# Altium project GatewayV2.PrjPcb
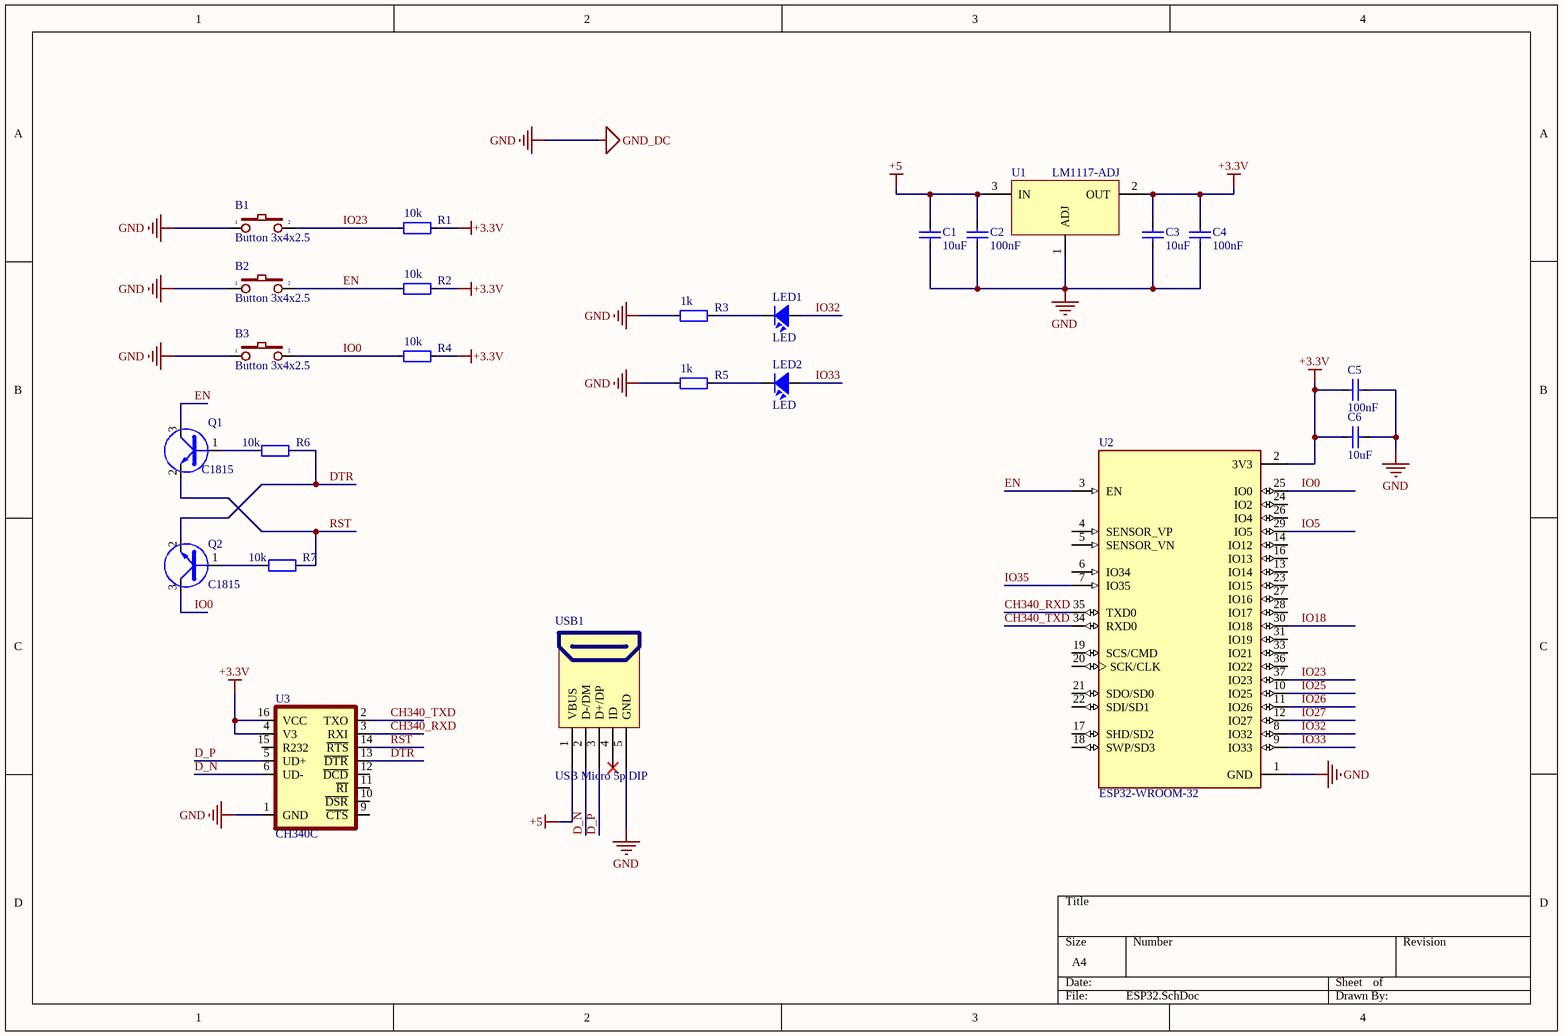
[diagram p0: ESP32.SchDoc]
2 sheets, 52 parts. Net scope: global (net labels, ports and power ports of the same name join across sheets).
Board file: GatewayV2.PcbDoc
Sheets:
  ESP32.SchDoc
  Power.SchDoc

## Sheet ESP32.SchDoc
size A4; SheetNumber: 1; SheetTotal: 2

### Parts
B1  Button 3x4x2.5  [Button 3x4x2.5]
B2  Button 3x4x2.5  [Button 3x4x2.5]
B3  Button 3x4x2.5  [Button 3x4x2.5]
C1  10uF  [CAP_0805]
C2  100nF  [CAP_0805]
C3  10uF  [CAP_0805]
C4  100nF  [CAP_0805]
C5  100nF  [CAP_0805]
C6  10uF  [CAP_0805]
LED1  LED  [LED-0805-Red]
LED2  LED  [LED-0805-Red]
Q1  C1815  [SOT23D]
Q2  C1815  [SOT23D]
R1  10k  [RES-SMD-0805]
R2  10k  [RES-SMD-0805]
R3  1k  [RES-SMD-0805]
R4  10k  [RES-SMD-0805]
R5  1k  [RES-SMD-0805]
R6  10k  [RES-SMD-0805]
R7  10k  [RES-SMD-0805]
U1  LM1117-ADJ  [LM1117-SOP]
U2  ESP32-WROOM-32  [MODULE_ESP32-WROOM-32]
U3  CH340C  [SO016]
USB1  USB Micro 5p DIP  [USB Micro 5p DIP]

### Nets
+3.3V: C3.1 C4.1 C5.1 C6.1 R1.1 R2.1 R4.1 U1.2(OUT) U2.2(3V3) U3.4(V3) U3.16(VCC)
+5: C1.1 C2.1 U1.3(IN) USB1.1(VBUS)
GND: B1.1 B2.1 B3.1 C1.2 C2.2 C3.2 C4.2 C5.2 C6.2 R3.2 R5.2 U1.1(ADJ) U2.1(GND) U3.1(GND) USB1.5(GND)  [also labelled GND_DC]
CH340_RXD: U2.35(TXD0) U3.3(RXI)
CH340_TXD: U2.34(RXD0) U3.2(TXO)
D_N: U3.6(UD-) USB1.2(D-/DM)
D_P: U3.5(UD+) USB1.3(D+/DP)
DTR: Q2.2(E) R6.1 U3.13(~{DTR})
EN: B2.2 Q1.3(C) R2.2 U2.3(EN)
IO0: B3.2 Q2.3(C) R4.2 U2.25(IO0)
IO5: U2.29(IO5)
IO18: U2.30(IO18)
IO23: B1.2 R1.2 U2.37(IO23)
IO25: U2.10(IO25)
IO26: U2.11(IO26)
IO27: U2.12(IO27)
IO32: LED1.1 U2.8(IO32)
IO33: LED2.1 U2.9(IO33)
IO35: U2.7(IO35)
RST: Q1.2(E) R7.1 U3.14(~{RTS})
NetLED1_2: LED1.2 R3.1
NetLED2_2: LED2.2 R5.1
NetQ1_1: Q1.1(B) R6.2
NetQ2_1: Q2.1(B) R7.2

Not connected (* = marked no-connect by the designer): U2 4(SENSOR_VP) 5(SENSOR_VN) 6(IO34) 13(IO14) 14(IO12) 16(IO13) 17(SHD/SD2) 18(SWP/SD3) 19(SCS/CMD) 20(SCK/CLK) 21(SDO/SD0) 22(SDI/SD1) 23(IO15) 24(IO2) 26(IO4) 27(IO16) 28(IO17) 31(IO19) 33(IO21) 36(IO22); U3 9(~{CTS}) 10(~{DSR}) 11(~{RI}) 12(~{DCD}) 15(R232); USB1 4(ID)*

### Library data of the parts
C1-C6 = CapSMD: Capacitor; Value: 33p; Published: 8-Jun-2000; LatestRevisionDate: 17-Jul-2002; LatestRevisionNote: Re-released for DXP Platform.; PackageReference: RAD-0.3; Publisher: Altium Limited
LED1 LED2 = LED: LED Single colour Green and Red; Value: LED 3 ly Single Colour
Q1 Q2 = 2SC1815: NPN 600mW, ECB; Value: C1815
R1-R7 = Resistor - SMD: Resistor; Manufacturer: Generic Components; Class: Passive; Published: 08/06/2000; Publisher: Altium Hobart Technology Centre
U1 = LM1117-ADJ: 800mA Low-Dropout Linear Regulator; Creator: Nguyen Ba Bien; Website: http://group3i.net
U2 = ESP32-WROOM-32: Bluetooth, WiFi Transceiver Module 2.4GHz ~ 2.5GHz Surface Mount; MF: Espressif Systems; Package: Module Espressif Systems; Digi-Key_Part_Number: 1904-1010-1-ND; Digi-Key_Purchase_URL: https://www.digikey.com/product-detail/en/espressif-systems/ESP32-WROOM-32/1904-1010-1-ND/8544305?utm_source=snapeda&utm_medium=aggregator&utm_campaign=symbol; Value: *; MP: ESP32-WROOM-32; SnapEDA_Link: https://www.snapeda.com/parts/ESP32-WROOM-32/Espressif%20Systems/view-part/2753322/?ref=snap
U3 = CH340C: USB to serial chip CH340; MF: WCH; Package: Package; Check_prices: https://www.snapeda.com/parts/CH340C/WCH/view-part/5428851/?ref=eda; Value: *; Price: None; MP: CH340C; Availability: Unavailable; SnapEDA_Link: https://www.snapeda.com/parts/CH340C/WCH/view-part/5428851/?ref=snap
USB1 = USB Micro 5p DIP: USB Type B; Ten: MicroUSB MK5P DIP; Ma_Hang: MH005145

## Sheet Power.SchDoc
size A2; SheetNumber: 2; SheetTotal: 2
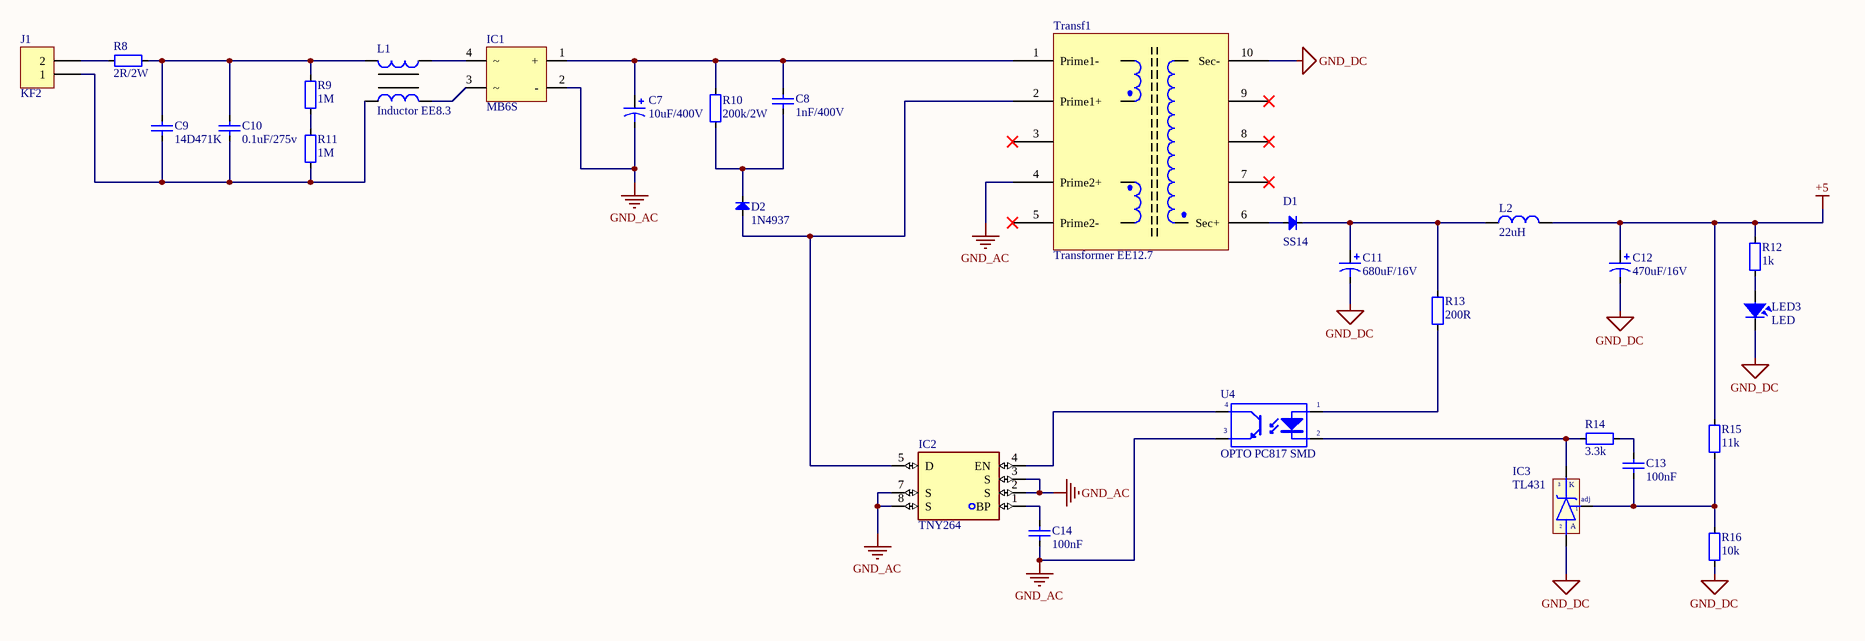
[diagram p1: Power.SchDoc]

### Parts
C7  10uF/400V  [C10mm]
C8  1nF/400V  [103/2KV]
C9  14D471K  [103/2KV]
C10  0.1uF/275v  [Cap AC filter]
C11  680uF/16V  [C8mm]
C12  470uF/16V  [C8mm]
C13  100nF  [CAP_0805]
C14  100nF  [CAP_0805]
D1  SS14  [DO-214AC(SMA)]
D2  1N4937  [DIO-1AN]
IC1  MB6S  [MB6S]
IC2  TNY264  [TNY264]
IC3  TL431  [qto-92]
J1  KF2  [KF2-5.08T]
L1  Inductor EE8.3  [Inductor EE8.3]
L2  22uH  [L_SMD]
LED3  LED  [LED-0805-Red]
R8  2R/2W  [RES-1WW]
R9  1M  [RES-SMD-1206]
R10  200k/2W  [RES-1WW]
R11  1M  [RES-SMD-1206]
R12  1k  [RES-SMD-0805]
R13  200R  [RES-SMD-0805]
R14  3.3k  [RES-SMD-0805]
R15  11k  [RES-SMD-0805]
R16  10k  [RES-SMD-0805]
Transf1  Transformer EE12.7  [Transformer EE12.7]
U4  OPTO PC817 SMD  [SOP4]

### Nets
+5: C12.1 L2.2 R12.2 R15.2
GND_AC: C7.2 C14.1 IC1.2(-) IC2.2(S) IC2.3(S) IC2.7(S) IC2.8(S) Transf1.4(Prime2+) U4.3(E)
GND_DC: C11.2 C12.2 IC3.2(A) LED3.2 R16.1 Transf1.10(Sec-)  [project net GND]
NetC7_1: C7.1 C8.1 IC1.1(+) R10.2 Transf1.1(Prime1-)
NetC8_2: C8.2 D2.2(K) R10.1
NetC9_1: C9.1 C10.1 J1.1 L1.4 R11.1
NetC9_2: C9.2 C10.2 L1.2 R8.2 R9.2
NetC11_1: C11.1 D1.2(K) L2.1 R13.2
NetC13_1: C13.1 IC3.1(adj) R15.1 R16.2
NetC13_2: C13.2 R14.1
NetC14_2: C14.2 IC2.1(BP)
NetD1_1: D1.1(A) Transf1.6(Sec+)
NetD2_1: D2.1(A) IC2.5(D) Transf1.2(Prime1+)
NetIC1_3: IC1.3 L1.3
NetIC1_4: IC1.4 L1.1
NetIC2_4: IC2.4(EN) U4.4(C)
NetIC3_3: IC3.3(K) R14.2 U4.2(K)
NetJ1_2: J1.2 R8.1
NetLED3_1: LED3.1 R12.1
NetR9_1: R9.1 R11.2
NetR13_1: R13.1 U4.1(A)

Not connected (* = marked no-connect by the designer): Transf1 3* 5(Prime2-)* 7* 8* 9*

### Library data of the parts
C7 C11 C12 = Cap Pol: Polarized Capacitor (Axial); Published: 8-Jun-2000; LatestRevisionDate: 17-Jul-2002; LatestRevisionNote: Re-released for DXP Platform.; PackageReference: POLAR0.8; Publisher: Altium Limited
C8 = Cap2KV: CAP CERAMIC; Published: 8-Jun-2000; LatestRevisionDate: 17-Jul-2002; LatestRevisionNote: Re-released for DXP Platform.; PackageReference: RAD-0.3; Publisher: Altium Limited
C9 = Cap2KV: Capacitor Ceramic 2KV; Published: 8-Jun-2000; LatestRevisionDate: 17-Jul-2002; LatestRevisionNote: Re-released for DXP Platform.; PackageReference: RAD-0.3; Publisher: Altium Limited
C10 = Cap AC filter: Tụ lọc nguồn AC 0.1uf 275v 10mm
C13 C14 = CapSMD: Capacitor; Value: 33p; Published: 8-Jun-2000; LatestRevisionDate: 17-Jul-2002; LatestRevisionNote: Re-released for DXP Platform.; PackageReference: RAD-0.3; Publisher: Altium Limited
D1 = Diode SMD: Diode Schottky / 1N5819; Code - JEDEC: DO-214-AB; Value: 1N5007; Published: 8-Jun-2000; Revision: July-2002: Re-released for DXP Platform.; Publisher: Altium Limited
D2 = Diode SMD: Diode Schottky / 1N4937; Code - JEDEC: DO-214-AB; Value: 1N5007; Published: 8-Jun-2000; Revision: July-2002: Re-released for DXP Platform.; Publisher: Altium Limited
IC2 = TNY264: IC Power
IC3 = TL431: Programmable Shunt Regulator; Value: TL431
J1 = KF2: Manufacturer: Würth Elektronik eiSos GmbH; partNo: 691103110002; ComponentLink1 Description: Manufacturer; ComponentLink2 Description: Datasheet; NoPins: 2; Created Date: 29 October 2013; ComponentLink1URL: http://www.we-online.com; ComponentLink2URL: http://katalog.we-online.de/em/datasheet/6911031100xx.pdf; Created by: Karrer Zheng
L2 = Inductor: CD73R 22uH 1.23A 7345; Value: 150 mH
LED3 = LED: as LED1 on sheet ESP32
R8-R16 = Resistor - SMD: as R1 on sheet ESP32; Published: 08/06/2000; Publisher: Altium Hobart Technology Centre
Transf1 = Tranformer EE16
U4 = OPTO PC817 SMD: Single Opto; Value: PC817

## Nets that join several sheets
+5: ESP32 (C1.1 C2.1 U1.3 USB1.1), Power (C12.1 L2.2 R12.2 R15.2)
GND: ESP32 (15 pins), Power (6 pins)